# Altium project Sensor_Cleaning.PrjPcb
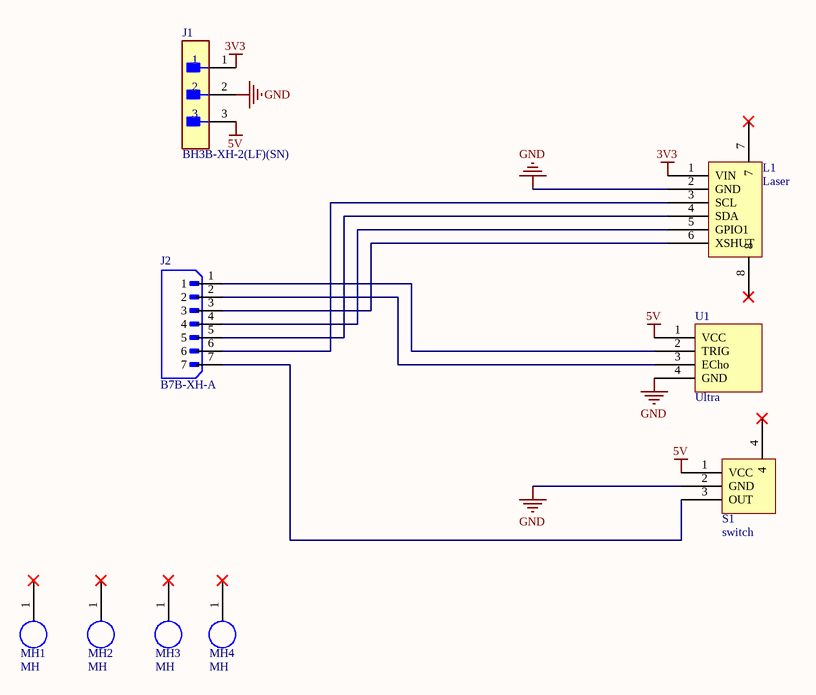
[diagram p0: sensor_sheet.SchDoc]
1 sheet, 9 parts. Net scope: global (net labels, ports and power ports of the same name join across sheets).
Board file: PCB2.PcbDoc

## Sheet sensor_sheet.SchDoc
size A; SheetNumber: 1; SheetTotal: 1

### Parts
J1  BH3B-XH-2(LF)(SN)  [FP-BH3B-XH-2_LF_SN-MFG]
J2  B7B-XH-A  [JST_B7B-XH-A]
L1  Laser  [laser_1]
MH1  MH  [MH]
MH2  MH  [MH]
MH3  MH  [MH]
MH4  MH  [MH]
S1  switch  [Switch]
U1  Ultra  [UltraSoic]

### Nets
3V3: J1.1 L1.1(VIN)
5V: J1.3 S1.1(VCC) U1.1(VCC)
GND: J1.2 L1.2(GND) S1.2(GND) U1.4(GND)
NetJ2_1: J2.1 U1.2(TRIG)
NetJ2_2: J2.2 U1.3(ECho)
NetJ2_3: J2.3 L1.6(XSHUT)
NetJ2_4: J2.4 L1.5(GPIO1)
NetJ2_5: J2.5 L1.4(SDA)
NetJ2_6: J2.6 L1.3(SCL)
NetJ2_7: J2.7 S1.3(OUT)

Not connected (* = marked no-connect by the designer): L1 7* 8*; MH1 1*; MH2 1*; MH3 1*; MH4 1*; S1 4*

### Library data of the parts
J1 = CMP-17439-000649-1: CONN HEADER VERT 3POS 2.5MM; Voltage Rating: 250V; Number of Positions: 3; Mated Stacking Heights: 9.8mm; Pitch: 2.5mm; Contact Finish - Mating: TIN; Series: XH; Width: 5.75mm; Insulation Material: Nylon; Packaging: Bulk; Min Operating Temperature: -25°C; Connector Type: Header; Insulation Color: Natural; Height: 14.2mm; Contact Material: Brass; Length: 9.9mm; Termination: Press-Fit; Fastening Type: Detent; Number of Poles: 3; Flammability Rating: UL94 V-0; Contact Type: Male Pin; Lead Free: Lead Free; Mount: Through Hole; Number of Rows: 1; Max Operating Temperature: 85°C; Contact Shape: Square
J2 = B7B-XH-A: Connector Header Through Hole 7 position 0.098 (2.50mm); MF: JST Sales; SnapEDA_Link: https://www.snapeda.com/parts/B7B-XH-A/JST+Sales+America+Inc./view-part/?ref=snap; Package: None; Value: *; MP: B7B-XH-A; Check_prices: https://www.snapeda.com/parts/B7B-XH-A/JST+Sales+America+Inc./view-part/?ref=eda
L1 = Laser_1